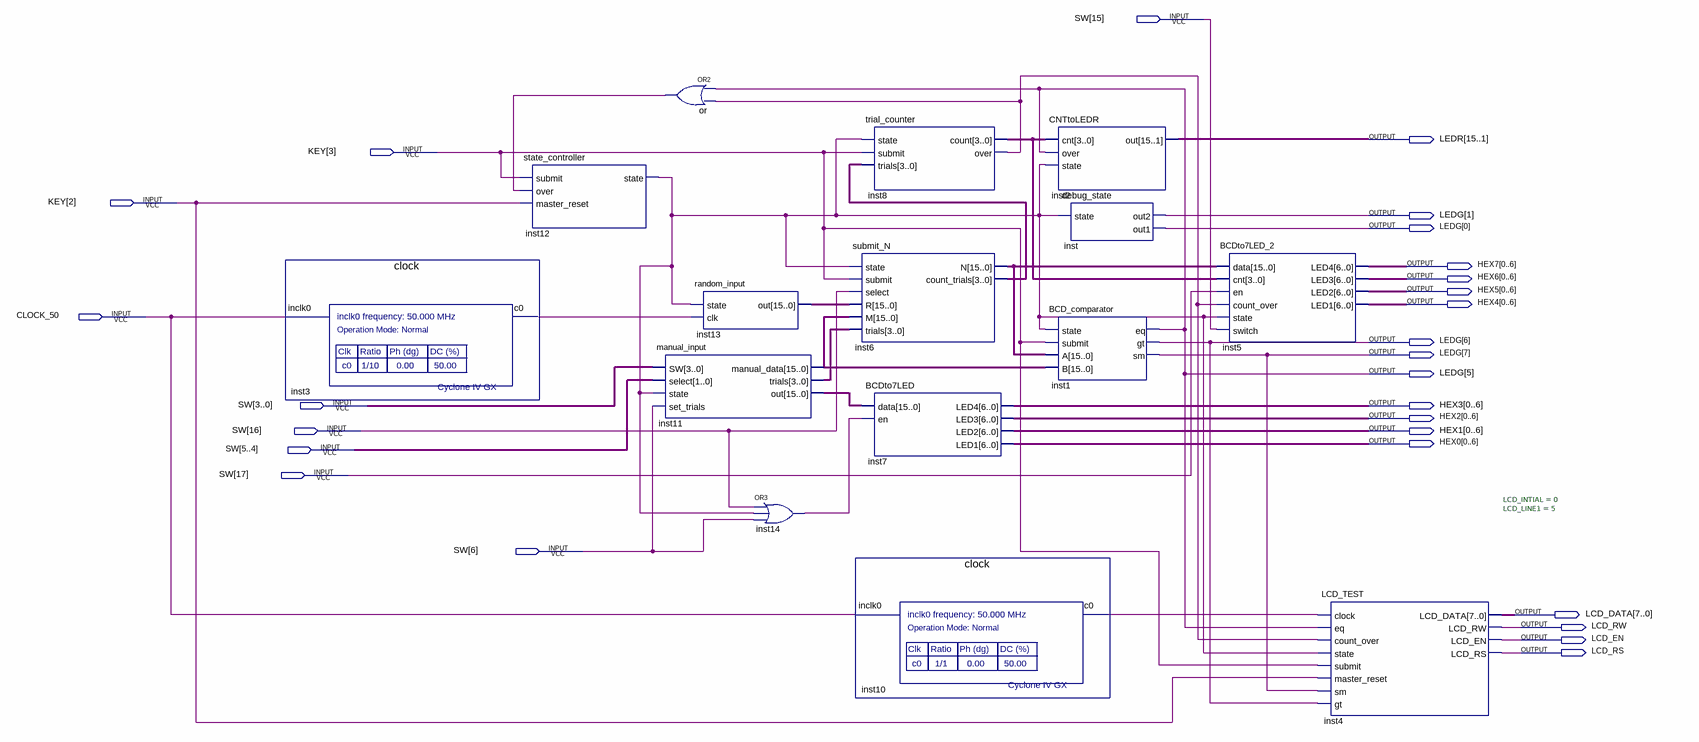
[diagram p0: schematic sheet]
// Quartus schematic Main.bdf as structural Verilog: 15 symbols, 27 pins
module Main (
  input  [17:0] SW,
  input  [3:2] KEY,
  input  CLOCK_50,
  output [15:1] LEDR,
  output [7:0] LEDG,
  output [0:6] HEX7,
  output [0:6] HEX6,
  output [0:6] HEX5,
  output [0:6] HEX4,
  output [0:6] HEX3,
  output [0:6] HEX2,
  output [0:6] HEX1,
  output [0:6] HEX0,
  output [7:0] LCD_DATA,
  output LCD_RW,
  output LCD_EN,
  output LCD_RS
);

  wire inst3_c0, inst8_over, inst10_c0, inst12_state, inst14_out, or_out;
  wire [3:0] inst6_count_trials, inst8_count, inst11_trials;
  wire [15:0] inst6_n, inst11_manual_data, inst11_out, inst13_out;

  clock inst3 (.inclk0(CLOCK_50), .c0(inst3_c0));
  state_controller inst12 (.submit(KEY[3]), .over(or_out), .master_reset(KEY[2]), .state(inst12_state));
  manual_input inst11 (
    .SW(SW[3:0]), .select(SW[5:4]), .state(inst12_state), .set_trials(SW[6]),
    .manual_data(inst11_manual_data), .trials(inst11_trials), .out(inst11_out));
  or \or  (or_out, LEDG[5], inst8_over);
  random_input inst13 (.state(inst12_state), .clk(inst3_c0), .out(inst13_out));
  or inst14 (inst14_out, SW[16], inst12_state, SW[6]);
  submit_N inst6 (
    .state(inst12_state), .submit(KEY[3]), .select(SW[16]), .R(inst13_out), .M(inst11_manual_data),
    .trials(inst11_trials), .N(inst6_n), .count_trials(inst6_count_trials));
  clock inst10 (.inclk0(CLOCK_50), .c0(inst10_c0));
  trial_counter inst8 (
    .state(inst12_state), .submit(KEY[3]), .trials(inst6_count_trials), .count(inst8_count), .over(inst8_over));
  BCDto7LED inst7 (.data(inst11_out), .en(inst14_out), .LED4(HEX3), .LED3(HEX2), .LED2(HEX1), .LED1(HEX0));
  CNTtoLEDR inst2 (.cnt(inst8_count), .over(LEDG[5]), .state(inst12_state), .out(LEDR));
  debug_state inst (.state(inst12_state), .out2(LEDG[1]), .out1(LEDG[0]));
  BCD_comparator inst1 (
    .state(inst12_state), .submit(KEY[3]), .A(inst6_n), .B(inst11_manual_data), .eq(LEDG[5]), .gt(LEDG[6]),
    .sm(LEDG[7]));
  BCDto7LED_2 inst5 (
    .data(inst6_n), .cnt(inst8_count), .en(SW[17]), .count_over(inst8_over), .state(inst12_state),
    .switch(SW[15]), .LED4(HEX7), .LED3(HEX6), .LED2(HEX5), .LED1(HEX4));
  LCD_TEST #(.LCD_INTIAL(0), .LCD_LINE1(5)) inst4 (
    .clock(inst10_c0), .eq(LEDG[5]), .count_over(inst8_over), .state(inst12_state), .submit(KEY[3]),
    .master_reset(KEY[2]), .sm(LEDG[7]), .gt(LEDG[6]), .LCD_DATA(LCD_DATA), .LCD_RW(LCD_RW), .LCD_EN(LCD_EN),
    .LCD_RS(LCD_RS));
endmodule
